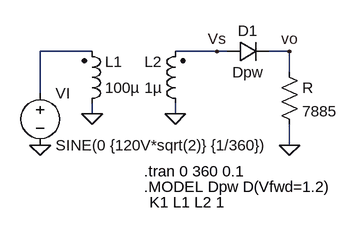
[diagram p0: schematic 7-2-1-b-1.asc]
7-2-1-b-1.asc, the LTspice schematic file:
Version 4
SHEET 1 880 680
WIRE 128 112 48 112
WIRE 320 112 256 112
WIRE 336 112 320 112
WIRE 432 112 400 112
WIRE 432 144 432 112
WIRE 48 176 48 112
WIRE 128 208 128 192
WIRE 256 208 256 192
WIRE 432 256 432 224
FLAG 48 256 0
FLAG 432 256 0
FLAG 320 112 Vs
FLAG 432 112 vo
FLAG 128 208 0
FLAG 256 208 0
SYMBOL voltage 48 160 R0
WINDOW 123 0 0 Left 0
SYMATTR SpiceLine Rser=1p
SYMATTR InstName VI
SYMATTR Value SINE(0 {120V*sqrt(2)} {1/360})
SYMBOL diode 336 128 R270
WINDOW 0 32 32 VTop 2
WINDOW 3 0 32 VBottom 2
SYMATTR InstName D1
SYMATTR Value Dpw
SYMBOL ind2 112 208 M180
WINDOW 0 36 80 Left 2
WINDOW 3 36 40 Left 2
SYMATTR InstName L1
SYMATTR Value 100µ
SYMATTR Type ind
SYMBOL ind2 272 208 R180
WINDOW 0 36 80 Left 2
WINDOW 3 36 40 Left 2
SYMATTR InstName L2
SYMATTR Value 1µ
SYMATTR Type ind
SYMBOL res 416 128 R0
SYMATTR InstName R
SYMATTR Value 7885
TEXT 208 296 Left 2 !.tran 0 360 0.1
TEXT 208 320 Left 2 !.MODEL Dpw D(Vfwd=1.2)
TEXT 216 344 Left 2 !K1 L1 L2 1

The netlist it stands for:
* 7-2-1-b-1.asc
VI N001 0 SINE(0 {120V*sqrt(2)} {1/360}) Rser=1p
D1 Vs vo Dpw
L1 0 N001 100µ
L2 0 Vs 1µ
R vo 0 7885
.model D D
.lib standard.dio
.tran 0 360 0.1
.MODEL Dpw D(Vfwd=1.2)
K1 L1 L2 1
.backanno
.end

* Results of the author's LTspice run, read from the files saved beside the schematic
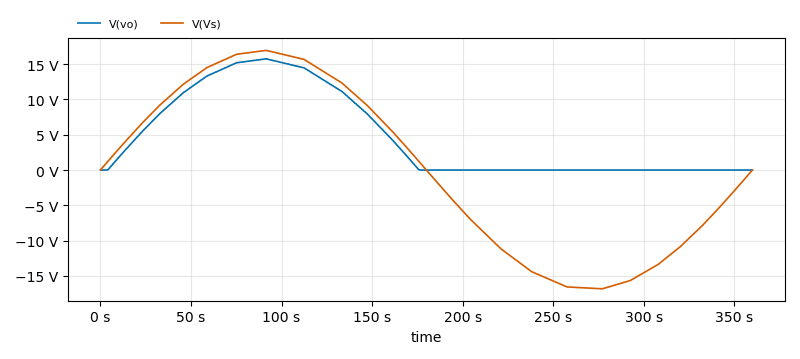
[diagram p1: Transient Analysis of 7-2-1-b-1.asc, plotted from the saved traces]
* Transient Analysis, 1 run:
*   V(vo): min 0 V, max 15.76 V, average 4.779 V, rms 7.696 V, last 0 V
*   V(Vs): min -16.84 V, max 16.96 V, average -1.681 mV, rms 11.95 V, last 0 V